# EAGLE design arm_PCB3 (EAGLE 9.1.0)
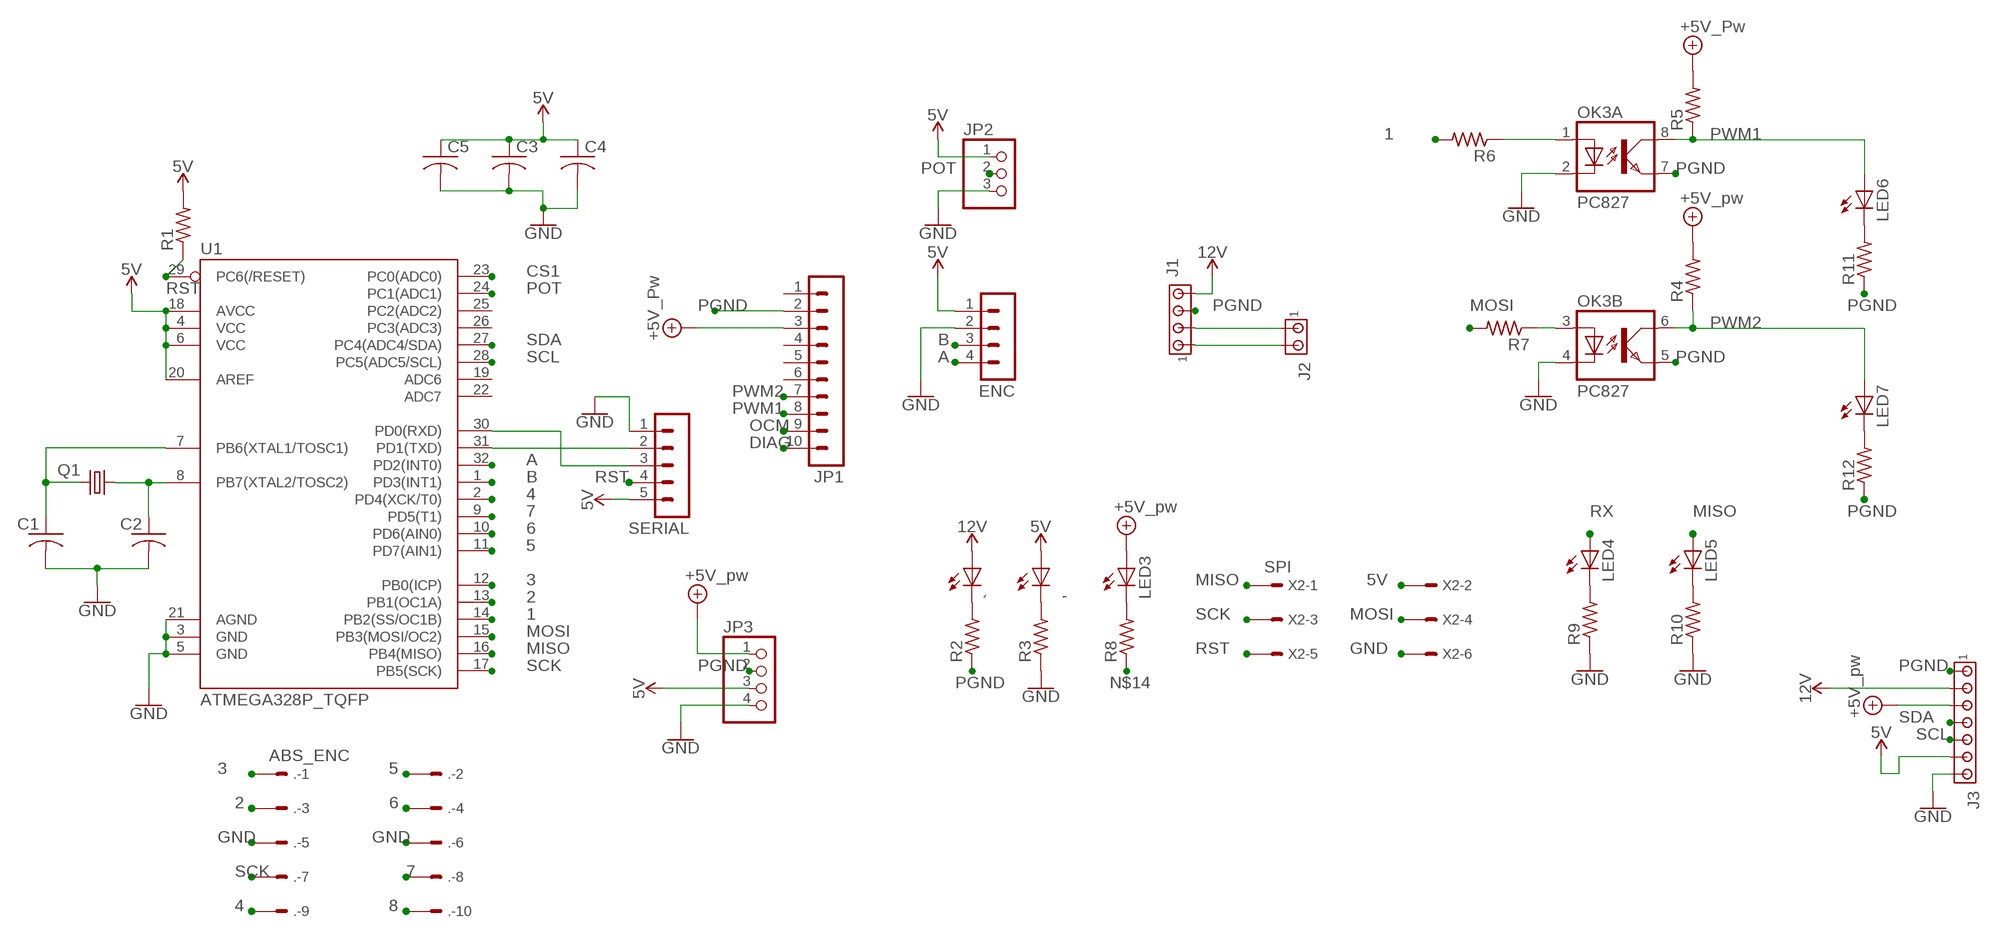
[diagram p0: schematic, sheet 1]

## Parts
,  LEDSMT1206  [1206]
.  ABS_ENC  057-010-1  [057-010-1]
`  LEDSMT1206  [1206]
C1  C-US025-024X044  [C025-024X044]
C2  C-US025-024X044  [C025-024X044]
C3  C-USC1206  [C1206]
C4  C-USC1206  [C1206]
C5  C-USC1206  [C1206]
ENC  MA04-1  [MA04-1]
J1  MTA04-100  [10X04MTA]
J2  MTA02-156  [1X2MTA]
J3  MTA07-156  [1X7MTA]
JP1  MA10-1  [MA10-1]
JP2  PINHD-1X3  [1X03]
JP3  PINHD-1X4  [1X04]
LED3  LEDSMT1206  [1206]
LED4  LEDSMT1206  [1206]
LED5  LEDSMT1206  [1206]
LED6  LEDSMT1206  [1206]
LED7  LEDSMT1206  [1206]
OK3  PC827  [DIL08]
Q1  CRYSTALHC49U-V  [HC49U-V]
R1  R-US_R0805  [R0805]
R2  R-US_R0805  [R0805]
R3  R-US_R0805  [R0805]
R4  R-US_R0805  [R0805]
R5  R-US_R0805  [R0805]
R6  R-US_R0805  [R0805]
R7  R-US_R0805  [R0805]
R8  R-US_R0805  [R0805]
R9  R-US_R0805  [R0805]
R10  R-US_R0805  [R0805]
R11  R-US_R0805  [R0805]
R12  R-US_R0805  [R0805]
SERIAL  MA05-1  [MA05-1]
U1  ATMEGA328P_TQFP  [TQFP32-08]
X2  SPI  057-006-1  [057-006-1]

## Nets
1: R6.2 U1.14(PB2(SS/OC1B))
2: ..3 U1.13(PB1(OC1A))
3: ..1 U1.12(PB0(ICP))
4: ..9 U1.2(PD4(XCK/T0))
5: ..2 U1.11(PD7(AIN1))
5V: ,.A C3.1 C4.1 C5.1 ENC.1 J3.6 JP2.1 JP3.3 R1.2 SERIAL.5 U1.4(VCC) U1.6(VCC) U1.18(AVCC) U1.20(AREF) X2.2
6: ..4 U1.10(PD6(AIN0))
7: ..8 U1.9(PD5(T1))
8: ..10
12V: `.A J1.4 J3.2
+5V: J3.3 JP1.3 JP3.1 LED3.A R4.2 R5.2 ; supply symbol labelled +5V_Pw, +5V_pw
A: ENC.4 U1.32(PD2(INT0))
B: ENC.3 U1.1(PD3(INT1))
CS1: U1.23(PC0(ADC0))
DIAG: JP1.10
GND: ..5 ..6 C1.2 C2.2 C3.2 C4.2 C5.2 ENC.2 J3.7 JP2.3 JP3.4 OK3.2(A:C) OK3.4(B:C) R3.1 R9.1 R10.1 SERIAL.1 U1.3(GND) U1.5(GND) U1.21(AGND) X2.6
MISO: LED5.A U1.16(PB4(MISO)) X2.1
MOSI: R7.2 U1.15(PB3(MOSI/OC2)) X2.4
N$1: C1.1 Q1.2 U1.7(PB6(XTAL1/TOSC1))
N$2: J1.2 J2.1
N$3: C2.1 Q1.1 U1.8(PB7(XTAL2/TOSC2))
N$4: `.C R2.2
N$5: ,.C R3.2
N$6: J1.1 J2.2
N$7: LED6.C R11.2
N$8: LED3.C R8.2
N$9: OK3.1(A:A) R6.1
N$10: OK3.3(B:A) R7.1
N$11: LED4.C R9.2
N$12: LED5.C R10.2
N$13: LED7.C R12.2
N$14: R8.1
OCM: JP1.9
PGND: J1.3 J3.1 JP1.2 JP3.2 OK3.5(B:EMIT) OK3.7(A:EMIT) R2.1 R11.1 R12.1
POT: JP2.2 U1.24(PC1(ADC1))
PWM1: JP1.8 LED6.A OK3.8(A:COL) R5.1
PWM2: JP1.7 LED7.A OK3.6(B:COL) R4.1
RST: R1.1 SERIAL.4 U1.29(PC6(/RESET)) X2.5
RX: LED4.A SERIAL.3 U1.30(PD0(RXD))
SCK: ..7 U1.17(PB5(SCK)) X2.3
SCL: J3.5 U1.28(PC5(ADC5/SCL))
SDA: J3.4 U1.27(PC4(ADC4/SDA))
TX: SERIAL.2 U1.31(PD1(TXD))
Unconnected: JP1.1 JP1.4 JP1.5 JP1.6 U1.19(ADC6) U1.22(ADC7) U1.25(PC2(ADC2)) U1.26(PC3(ADC3))

## Library data of the parts
, ` LED3-LED7 = adafruit:LED: LED OSRAM: - CHIPLED LG R971, LG N971, LY N971, LG Q971, LY Q971, LO R971, LY R971 LH N974, LH R974 LS Q976, LO Q976, LY Q976 LO Q996 - Hyper CHIPLED LW Q18S LB Q993, LB Q99A, LB R99A - SideLED LS A670, LO A670, LY A670, LG A670, LP A670 LB A673, LV A673, LT A673, LW A673 LH A674 LY A675 LS A676, LA A676, LO A676, LY A676, LW A676 LS A679, LY A679, LG A679 - Hyper Micro SIDELED® LS Y876, LA Y876, LO Y876, LY Y876 LT Y87S - SmartLED LW L88C, LW L88S LB L89C, LB L89S, LG L890 LS L89K, LO L89K, LY L89K LS L896, LA L896, LO L896, LY L896 - TOPLED LS T670, LO T670, LY T670, LG T670, LP T670 LSG T670, LSP T670, LSY T670, LOP T670, LYG T670 LG T671, LOG T671, LSG T671 LB T673, LV T673, LT T673, LW T673 LH T674 LS T676, LA T676, LO T676, LY T676, LB T676, LH T676, LSB T676, LW T676 LB T67C, LV T67C, LT T67C, LS T67K, LO T67K, LY T67K, LW E67C LS E67B, LA E67B, LO E67B, LY E67B, LB E67C, LV E67C, LT E67C LW T67C LS T679, LY T679, LG T679 LS T770, LO T770, LY T770, LG T770, LP T770 LB T773, LV T773, LT T773, LW T773 LH T774 LS E675, LA E675, LY E675, LS T675 LS T776, LA T776, LO T776, LY T776, LB T776 LHGB T686 LT T68C, LB T68C - Hyper Mini TOPLED® LB M676 - Mini TOPLED Santana® LG M470 LS M47K, LO M47K, LY M47K Source: http://www.osram.convergy.de/
. = con-panduit:057-010-: CONNECTOR 10-pin series 057 contact pc board low profile headers; OC_FARNELL: unknown; OC_NEWARK: unknown
C1-C5 = adafruit:C-US: CAPACITOR, American symbol
ENC = con-lstb:MA04-1: PIN HEADER; OC_FARNELL: unknown; OC_NEWARK: unknown
J1 = con-amp:MTA04-100: AMP connector
J2 = con-amp:MTA02-156: AMP connector
J3 = con-amp:MTA07-156: AMP connector
JP1 = con-lstb:MA10-1: PIN HEADER; OC_FARNELL: unknown; OC_NEWARK: unknown
JP2 = adafruit:PINHD-1X3: PIN HEADER
JP3 = pinhead:PINHD-1X4: PIN HEADER
OK3 = optocoupler:PC827: SHARP OPTO COUPLER; OC_FARNELL: unknown; OC_NEWARK: unknown
Q1 = adafruit:CRYSTAL: CRYSTAL; OC_FARNELL: 1666969; OC_NEWARK: unknown
R1-R12 = adafruit:R-US_: RESISTOR, American symbol
SERIAL = con-lstb:MA05-1: PIN HEADER; OC_FARNELL: unknown; OC_NEWARK: unknown
U1 = SparkFun-IC-Microcontroller:ATMEGA328P_TQFP: Popular 328P in QFP Storefront component: ATmega328 - TQFP <https://www.sparkfun.com/products/13448> (COM-13448) Datasheet <http://www.sparkfun.com/datasheets/Components/SMD/ATMega328.pdf> SparkFun Products SparkFun RedBoard - Programmed with Arduino <https://www.sparkfun.com/products/12757> (DEV-12757) Arduino Pro Mini 328 - 5V/16MHz <https://www.sparkfun.com/products/11113> (DEV-11113) Arduino Pro Mini 328 - 3.3V/8MHz <https://www.sparkfun.com/products/11114> (DEV-11114) SparkFun OpenLog <https://www.sparkfun.com/products/13712> (DEV-13712) SparkFun MicroView - OLED Arduino Module <https://www.sparkfun.com/products/12923> (DEV-12923) SparkFun Digital Sandbox <https://www.sparkfun.com/products/12651> (DEV-12651) SparkFun PicoBoard <https://www.sparkfun.com/products/11888> (WIG-11888) Arduino Fio <https://www.sparkfun.com/products/10116> (DEV-10116) LilyPad Arduino 328 Main Board <https://www.sparkfun.com/products/13342> (DEV-13342) SparkFun RedStick <https://www.sparkfun.com/products/13741> (DEV-13741) LilyPad MP3 <https://www.sparkfun.com/products/11013> (DEV-11013) LilyPad Arduino SimpleSnap <https://www.sparkfun.com/products/10941> (DEV-10941) SparkFun Stepoko <https://www.sparkfun.com/products/13899> (ROB-13899) SparkFun Geiger Counter <https://www.sparkfun.com/products/11345> (SEN-11345) SparkFun EL Sequencer <https://www.sparkfun.com/products/12781> (COM-12781) Arduino Pro 328 - 5V/16MHz <https://www.sparkfun.com/products/10915> (DEV-10915) CryptoCape <https://www.sparkfun.com/products/12773> (DEV-12773) SparkFun IR Thermometer Evaluation Board - MLX90614 <https://www.sparkfun.com/products/10740> (SEN-10740) SparkFun RedBot Mainboard <https://www.sparkfun.com/products/12097> (ROB-12097) Arduino Pro 328 - 3.3V/8MHz <https://www.sparkfun.com/products/10914> (DEV-10914) SparkFun Block for Intel® Edison - Arduino <https://www.sparkfun.com/products/13036> (DEV-13036) SparkFun Simon Says - Surface Mount Soldering Kit <https://www.sparkfun.com/products/10935> (KIT-10935) SparkFun 7-Segment Serial Display - Red <https://www.sparkfun.com/products/11441> (COM-11441) SparkFun 7-Segment Serial Display - White <https://www.sparkfun.com/products/11629> (COM-11629) SparkFun 7-Segment Serial Display - Yellow <https://www.sparkfun.com/products/11443> (COM-11443) SparkFun 7-Segment Serial Display - Kelly Green <https://www.sparkfun.com/products/11440> (COM-11440) SparkFun 7-Segment Serial Display - Blue <https://www.sparkfun.com/products/11442> (COM-11442) SparkFun OpenSegment Serial Display - 20mm (Blue) <https://www.sparkfun.com/products/11647> (COM-11647) SparkFun OpenSegment Serial Display - 20mm (Green) <https://www.sparkfun.com/products/11646> (COM-11646) SparkFun OpenSegment Serial Display - 20mm (White) <https://www.sparkfun.com/products/11648> (COM-11648) SparkFun OpenSegment Serial Display - 20mm (Red) <https://www.sparkfun.com/products/11644> (COM-11644) SparkFun OpenSegment Serial Display - 20mm (Yellow) <https://www.sparkfun.com/products/11645> (COM-11645) SparkFun OpenSegment Shield <https://www.sparkfun.com/products/13190> (DEV-13190); PROD_ID: IC-09069
X2 = con-panduit:057-006-: CONNECTOR 6-pin series 057 contact pc board low profile headers; OC_FARNELL: unknown; OC_NEWARK: unknown

## Board
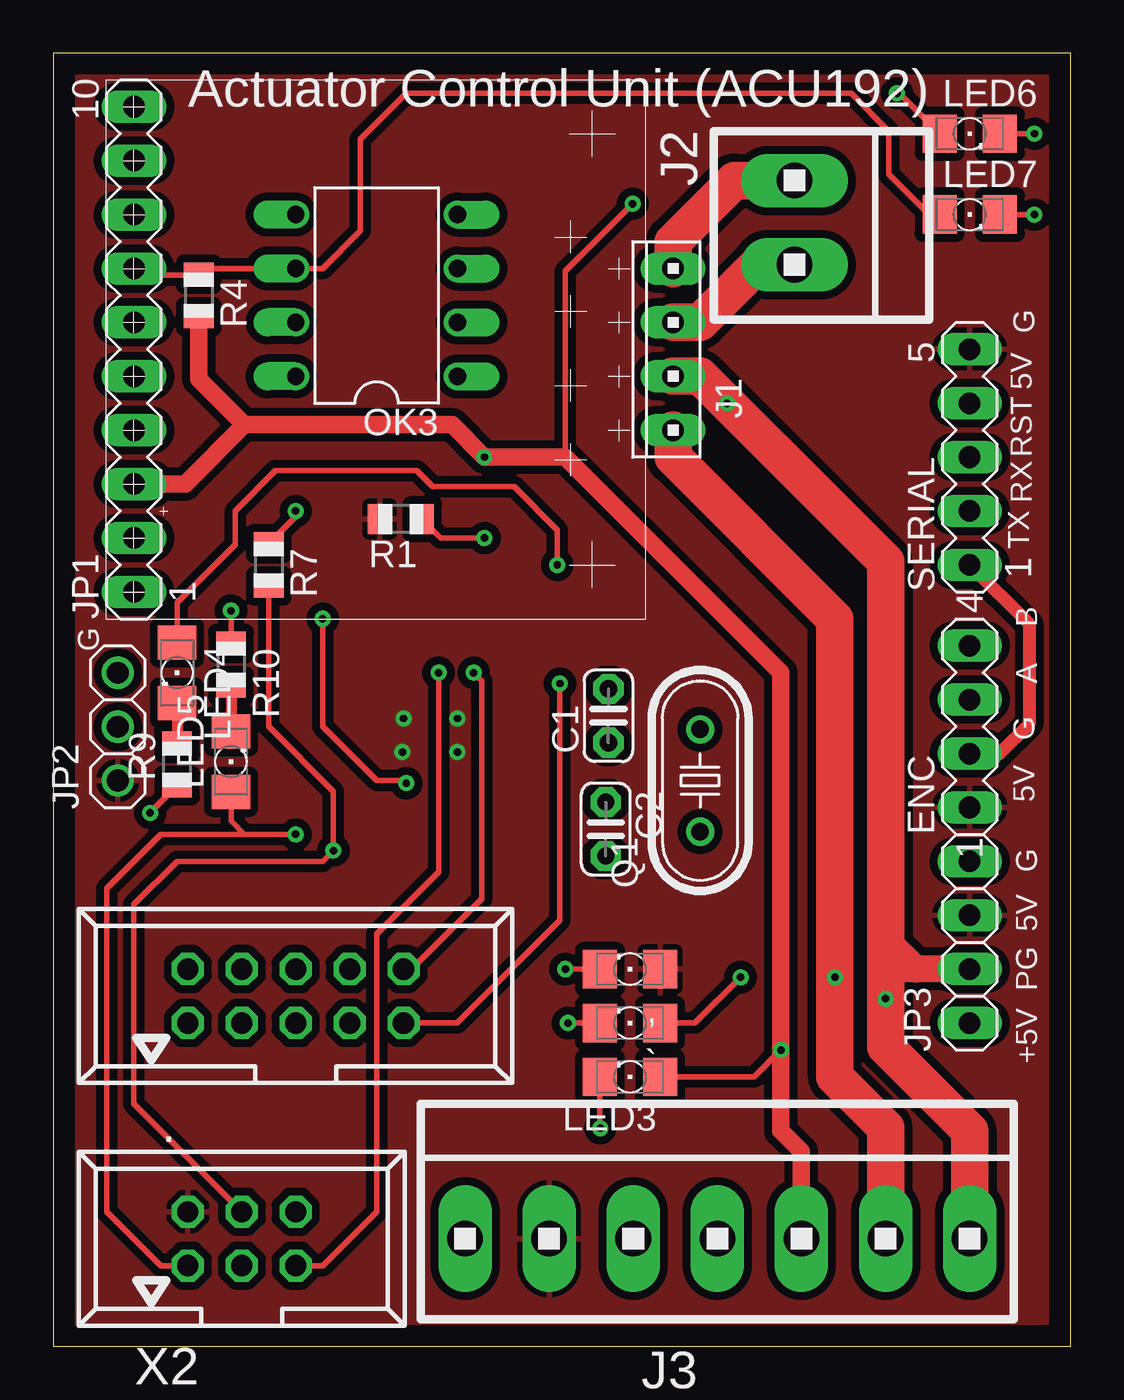
[diagram p1: board, top side]
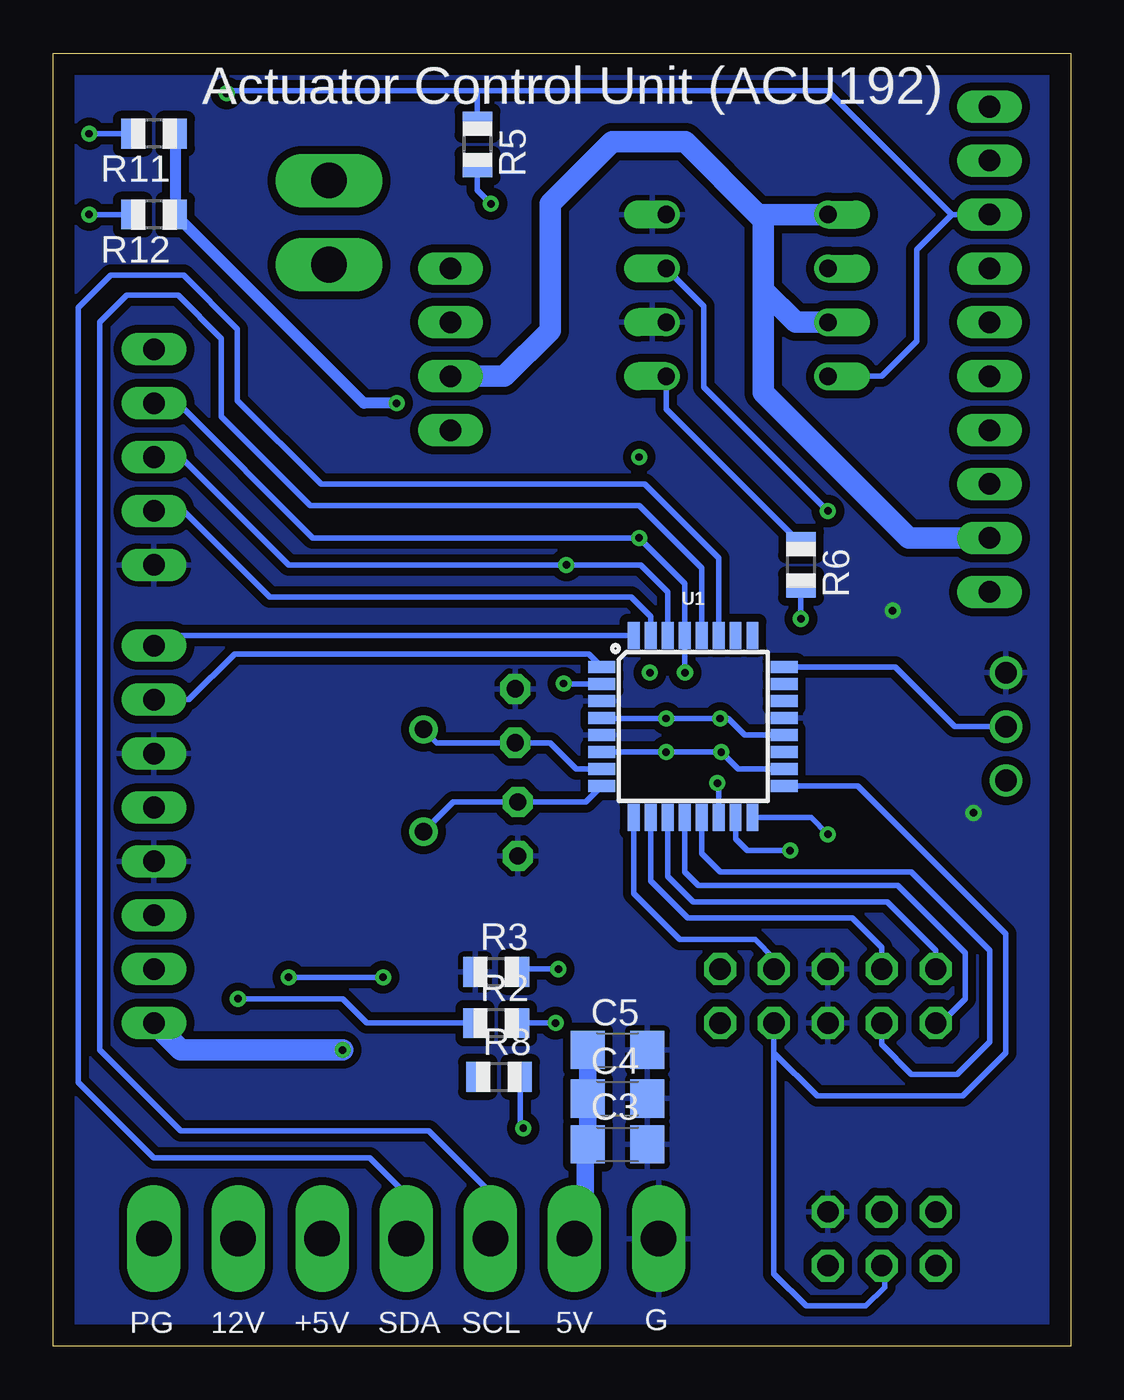
[diagram p2: board, bottom side, seen from below]

Size 47.93 x 60.95 mm. Coordinates in mm from the lower left corner, seen from the top.
Outline: 0,0 47.93,0 47.93,60.95 0,60.95 0,0
Copper layers (1*16): Top 0.035mm / dielectric 1.5mm / Bottom 0.035mm
Design rules "default *": minimum track width 6mil, minimum drill 0.35mm, track to track 15mil, track to pad 15mil, pad to pad 8mil, via to via 15mil, smd to smd 6mil, copper to edge 40mil, drill to drill 6mil, minimum pad ring 10mil, minimum via ring 8mil, stop-mask expansion 4mil, vias tented up to drill 0mil, thermal gap 10mil

### Footprints (pad centres in the part's own frame; a part is rotated, then mirrored left to right if it is on the bottom)
1206 = smd 1.6 x 1.803: A -1.422,0; C 1.422,0
057-010-1 = drill 1 octagon: 1 -5.08,-1.27; 2 -5.08,1.27; 3 -2.54,-1.27; 4 -2.54,1.27; 5 0,-1.27; 6 0,1.27; 7 2.54,-1.27; 8 2.54,1.27; 9 5.08,-1.27; 10 5.08,1.27
C025-024X044 = drill 0.813 pad 1.422 octagon: 1 -1.27,0; 2 1.27,0
C1206 = smd 1.6 x 1.8: 1 -1.4,0; 2 1.4,0
MA04-1 = drill 1.016 long: 1 -3.81,0; 2 -1.27,0; 3 1.27,0; 4 3.81,0
10X04MTA = drill 1.016 long: 1 3.81,0; 2 1.27,0; 3 -1.27,0; 4 -3.81,0
1X2MTA = drill 1.676 long: 1 1.981,0; 2 -1.981,0
1X7MTA = drill 1.676 long: 1 11.887,0; 2 7.925,0; 3 3.962,0; 4 0,0; 5 -3.962,0; 6 -7.925,0; 7 -11.887,0
MA10-1 = drill 1.016 long: 1 -11.43,0; 2 -8.89,0; 3 -6.35,0; 4 -3.81,0; 5 -1.27,0; 6 1.27,0; 7 3.81,0; 8 6.35,0; 9 8.89,0; 10 11.43,0
1X03 = drill 1.016: 1 -2.54,0; 2 0,0; 3 2.54,0
1X04 = drill 1.016 long: 1 -3.81,0; 2 -1.27,0; 3 1.27,0; 4 3.81,0
DIL08 = drill 0.813 offset: 1 -3.81,-3.81; 2 -1.27,-3.81; 3 1.27,-3.81; 4 3.81,-3.81; 5 3.81,3.81; 6 1.27,3.81; 7 -1.27,3.81; 8 -3.81,3.81
HC49U-V = drill 0.813: 1 -2.413,0; 2 2.413,0
R0805 = smd 1.1 x 1.4: 1 -1,0; 2 1,0
MA05-1 = drill 1.016 long: 1 -5.08,0; 2 -2.54,0; 3 0,0; 4 2.54,0; 5 5.08,0
TQFP32-08 = smd 1.27 x 0.559: 1 -4.293,2.8; 2 -4.293,2; 3 -4.293,1.2; 4 -4.293,0.4; 5 -4.293,-0.4; 6 -4.293,-1.2; 7 -4.293,-2; 8 -4.293,-2.8; 17 4.293,-2.8; 18 4.293,-2; 19 4.293,-1.2; 20 4.293,-0.4; 21 4.293,0.4; 22 4.293,1.2; 23 4.293,2; 24 4.293,2.8 | smd 0.559 x 1.27: 9 -2.8,-4.293; 10 -2,-4.293; 11 -1.2,-4.293; 12 -0.4,-4.293; 13 0.4,-4.293; 14 1.2,-4.293; 15 2,-4.293; 16 2.8,-4.293; 25 2.8,4.293; 26 2,4.293; 27 1.2,4.293; 28 0.4,4.293; 29 -0.4,4.293; 30 -1.2,4.293; 31 -2,4.293; 32 -2.8,4.293
057-006-1 = drill 1 octagon: 1 -2.54,-1.27; 2 -2.54,1.27; 3 0,-1.27; 4 0,1.27; 5 2.54,-1.27; 6 2.54,1.27

### Placement (x,y rotation side)
,  27.18,17.78 180 top
.  11.43,16.51 0 top
`  27.18,15.24 180 top
C1  26.16,29.72 90 top
C2  26.04,24.38 270 top
C3  21.34,9.53 0 bottom
C4  21.34,11.68 0 bottom
C5  21.34,13.97 0 bottom
ENC  43.18,29.21 90 top
J1  29.21,46.99 90 top
J2  34.92,52.96 270 top
J3  31.29,5.08 0 top
JP1  3.81,46.99 90 top
JP2  3.05,29.21 90 top
JP3  43.18,19.05 90 top
LED3  27.18,12.7 180 top
LED4  5.84,31.75 270 top
LED5  8.38,27.56 90 top
LED6  43.18,57.15 0 top
LED7  43.18,53.34 0 top
OK3  15.24,49.53 90 top
Q1  30.48,26.67 90 top
R1  16.38,38.99 180 top
R2  27.05,15.24 0 bottom
R3  27.05,17.65 0 bottom
R4  6.86,49.53 270 top
R5  27.94,56.64 270 bottom
R6  12.7,36.83 270 bottom
R7  10.16,36.83 270 top
R8  26.92,12.7 0 bottom
R9  5.84,27.43 90 top
R10  8.38,32.13 270 top
R11  43.18,57.15 180 bottom
R12  43.18,53.34 180 bottom
SERIAL  43.18,41.91 90 top
U1  17.78,29.21 0 bottom
X2  8.89,5.08 0 top

### Tracks (layer width: path | path; a pad name or v marks a point on that pad's centre or on a via)
1  (via drill 0.35)
  Top 0.254: v16.64,26.54 16.51,26.67 15.24,26.67 12.7,29.21 v12.7,34.29
  Bottom 0.254: U1.14 16.58,26.49 v16.64,26.54 | v12.7,34.29 R6.2
2
  Bottom 0.254: U1.13 17.38,23.22 16.51,22.35 7.49,22.35 3.81,18.67 3.81,14.35 5.33,12.83 7.49,12.83 8.89,14.22 ..3
3
  Bottom 0.254: U1.12 18.18,22.37 17.53,21.72 8.13,21.72 4.95,18.54 4.95,16.38 6.1,15.24 ..1
4  (via drill 0.35)
  Top 0.254: v23.88,31.24 23.88,20.07 19.05,15.24 ..9
  Bottom 0.254: U1.2 23.84,31.21 v23.88,31.24
5
  Bottom 0.254: U1.11 18.98,22.16 17.78,20.95 8.64,20.95 6.35,18.67 ..2
5V  (via drill 0.35)
  Bottom 0.254: U1.20 15.35,28.81 16.13,29.59 v16.51,29.59 v19.05,29.59 22.05,29.59 U1.4 | U1.18 15.65,27.21 v16.45,28.01 v19.05,28.01 U1.6
  Bottom 0.813: C5.1 C4.1 C3.1 22.86,9.4 22.86,5.59 J3.6
  pour Top: 0,0 0,60.96 48.26,60.96 48.26,0
6
  Bottom 0.254: ..4 8.89,18.8 10.29,20.19 18.03,20.19 19.78,21.94 U1.10
7
  Bottom 0.254: ..8 13.97,18.29 14.86,19.18 18.41,19.18 20.58,21.34 U1.9
8  (via drill 0.35)
  Top 0.254: v19.81,31.75 20.19,31.37 20.19,21.08 16.89,17.78 ..10
12V  (via drill 0.35)
  Top 0.254: `.A 30.23,15.24 v32.38,17.4
  Top 1.778: J1.4 29.21,41.91 36.83,34.29 v36.83,17.4 36.83,12.7 39.22,10.31 J3.2
  Bottom 0.254: v32.38,17.4 v36.83,17.4
+5V  (via drill 0.35)
  Top 0.254: LED3.A 33.02,12.7 v34.29,13.97 | v27.3,53.85 24.13,50.67 24.13,41.91
  Top 0.813: J3.3 35.26,9.2 34.29,10.16 v34.29,13.97 34.29,31.75 24.13,41.91 v20.32,41.91 18.8,43.43 9.02,43.43 | 9.02,43.43 6.22,40.64 JP1.3 | 9.02,43.43 6.86,45.59 R4.2
  Bottom 0.254: R5.2 27.94,54.48 v27.3,53.85
  Bottom 1.016: JP3.1 41.91,13.97 v34.29,13.97
A
  Bottom 0.254: U1.32 42.7,33.5 ENC.4
B
  Bottom 0.254: U1.1 22.7,32.64 39.37,32.64 41.53,30.48 ENC.3
GND  (via drill 0.35)
  Top 0.254: R10.1 v8.38,34.67 | R9.1 4.57,25.16 v4.57,25.15
  Top 0.61: SERIAL.1 45.97,34.04 45.97,29.34 44.58,27.94 ENC.2
  Bottom 0.254: v4.57,25.15 4.83,25.15
  pour Bottom: 0,0 0,60.96 48.26,60.96 48.26,0
MISO  (via drill 0.35)
  Top 0.254: X2.1 5.08,3.81 2.54,6.35 2.54,21.59 5.08,24.13 9.02,24.13 | v11.43,24.13 9.02,24.13 | LED5.A 8.38,24.77 9.02,24.13
  Bottom 0.254: U1.16 12.22,24.92 v11.43,24.13
MOSI  (via drill 0.35)
  Top 0.254: X2.4 3.81,11.43 3.81,20.83 5.84,22.86 12.7,22.86 v13.21,23.37 13.21,26.16 10.16,29.21 R7.2
  Bottom 0.254: U1.15 15.78,23.91 15.24,23.37 v13.21,23.37
N$1
  Bottom 0.254: U1.7 23.27,27.21 24.51,28.45 C1.1 29.84,28.45 Q1.2
N$2
  Top 1.778: J1.2 30.48,48.26 33.2,50.98 J2.1
N$3
  Bottom 0.254: U1.8 22.83,25.65 C2.1 29.08,25.65 Q1.1
N$4  (via drill 0.35)
  Top 0.254: `.C v24.26,15.24
  Bottom 0.254: v24.26,15.24 R2.2
N$5  (via drill 0.35)
  Top 0.254: ,.C v24.13,17.78
  Bottom 0.254: v24.13,17.78 25.92,17.78 R3.2
N$6
  Top 1.778: J1.1 29.21,52.07 32.08,54.94 J2.2
N$7  (via drill 0.35)
  Top 0.254: LED6.C v46.23,57.15
  Bottom 0.254: v46.23,57.15 R11.2
N$8  (via drill 0.35)
  Top 0.254: LED3.C 25.76,10.31 v25.78,10.29
  Bottom 0.254: v25.78,10.29 25.92,10.43 R8.2
N$9
  Bottom 0.254: R6.1 19.05,44.18 OK3.1
N$10  (via drill 0.35)
  Top 0.254: R7.1 11.43,39.1 v11.43,39.37
  Bottom 0.254: OK3.3 17.27,49.02 17.27,45.21 v11.43,39.37
N$11
  Top 0.508: LED4.C R9.2
N$12
  Top 0.508: R10.2 LED5.C
N$13  (via drill 0.35)
  Top 0.254: v46.23,53.34 LED7.C
  Bottom 0.254: R12.2 v46.23,53.34
PGND  (via drill 0.35)
  Top 1.27: JP3.2 40.64,17.78 | 40.64,17.78 39.22,17.78 | 40.64,17.78 39.37,19.05 39.22,19.05
  Top 1.778: J1.3 30.48,45.72 v31.75,44.45 39.22,36.98 39.22,19.05 39.22,17.78 v39.22,16.38 39.22,14.12 43.18,10.16 J3.1
  Bottom 0.254: R2.1 33.15,15.24 34.29,16.38 v39.22,16.38
  Bottom 0.508: R11.1 R12.1 33.29,44.45 v31.75,44.45
  Bottom 1.016: J1.3 26.67,45.72 24.51,47.88 24.51,53.85 21.59,56.77 18.16,56.77 14.73,53.34 | 14.73,53.34 OK3.5 | OK3.7 12.95,48.26 14.48,49.78 | 14.48,49.78 14.48,53.09 14.73,53.34 | 14.48,49.78 14.48,44.96 7.62,38.1 JP1.2
POT
  Bottom 0.254: U1.24 8.26,32.01 5.46,29.21 JP2.2
PWM1  (via drill 0.35)
  Top 0.254: v39.75,59.05 39.85,59.05 LED6.A
  Bottom 0.254: JP1.8 5.59,53.34 | 27.94,59.18 39.75,59.18 v39.75,59.05 | R5.1 27.94,59.18 | 5.59,53.34 11.43,59.18 24.13,59.18 27.94,59.18 | 5.59,53.34 7.24,51.69 7.24,47.37 8.89,45.72 OK3.8
PWM2
  Top 0.254: JP1.7 4.12,50.49 6.35,50.49 6.39,50.53 R4.1 7.13,50.8 OK3.6 12.7,50.8 14.48,52.58 14.48,56.9 16.64,59.05 37.59,59.05 39.37,57.28 39.37,55.24 41.27,53.34 LED7.A
RST  (via drill 0.35)
  Top 0.254: v18.16,31.75 18.16,22.35 15.24,19.43 15.24,6.35 12.7,3.81 X2.5 | v20.32,38.1 18.27,38.1 R1.1
  Bottom 0.254: v18.16,31.75 18.18,31.77 U1.29 18.18,35.96 v20.32,38.1 35.69,38.1 42.04,44.45 SERIAL.4
RX  (via drill 0.35)
  Top 0.254: LED4.A 5.84,35.05 8.57,37.78 8.57,39.37 10.47,41.27 17.14,41.27 17.89,40.51 21.72,40.51 23.75,38.48 v23.75,36.83
  Bottom 0.254: SERIAL.3 41.91,41.91 36.83,36.83 v23.75,36.83 20.25,36.83 18.98,35.56 U1.30
SCK
  Bottom 0.254: U1.17 10.03,26.41 3.05,19.43 3.05,13.84 5.08,11.81 11.94,11.81 13.97,13.84 | 13.97,13.84 ..7 | 13.97,13.84 13.97,3.43 12.45,1.91 9.65,1.91 8.76,2.79 8.76,3.68 X2.3
SCL
  Bottom 0.254: U1.28 17.38,36.68 20.32,39.62 35.81,39.62 40.01,43.81 40.01,44.45 40.01,47.5 42.04,49.53 44.45,49.53 45.72,48.26 45.72,13.97 41.91,10.16 30.23,10.16 27.3,7.24 27.3,5.11 J3.5
SDA
  Bottom 0.254: U1.27 16.58,37.15 20.07,40.64 35.31,40.64 39.24,44.58 39.24,47.94 41.78,50.48 45.21,50.48 46.74,48.96 46.74,12.45 43.18,8.89 33.02,8.89 31.37,7.24 31.37,5.16 J3.4
TX
  Bottom 0.254: U1.31 19.78,34.38 20.7,35.31 37.72,35.31 41.78,39.37 SERIAL.2

### Text on the board
tNames: Actuator Control Unit (ACU192) | G | 5V | RST | RX | TX | B | G | A | G | 5V | G | 5V | PG | +5V
bNames: Actuator Control Unit (ACU192) | G | 5V | SCL | SDA | +5V | 12V | PG